# EAGLE schematic Sample and Hold Main (EAGLE 9.6.2)
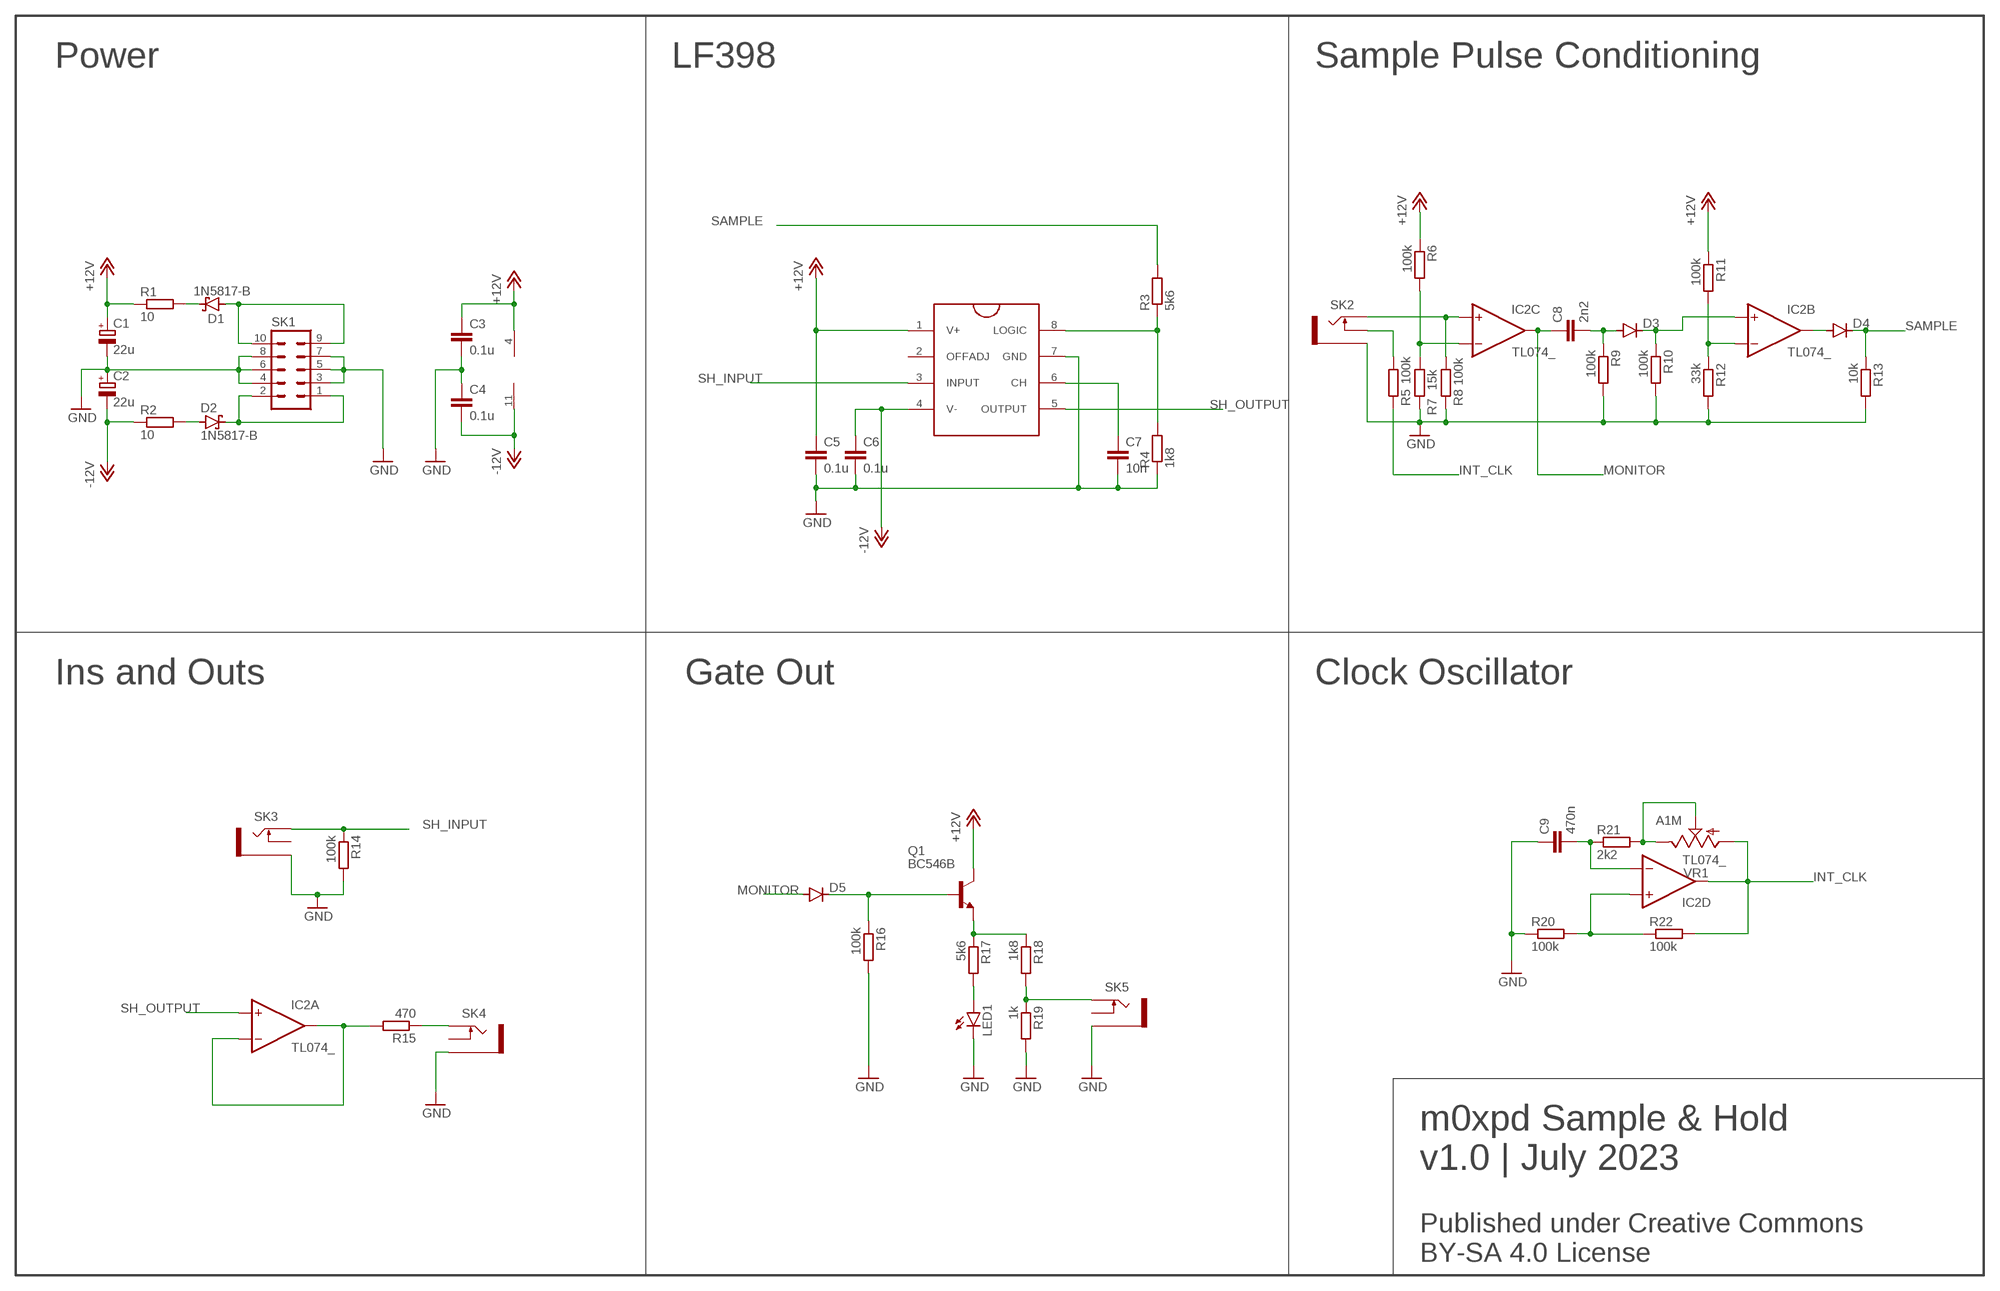
[diagram p0: schematic, sheet 1]

## Parts
C1  22u  CPOL-EUE2.5-6  [E2,5-6]
C2  22u  CPOL-EUE2.5-6  [E2,5-6]
C3  0.1u  C-EU050-024X044  [C050-024X044]
C4  0.1u  C-EU050-024X044  [C050-024X044]
C5  0.1u  C-EU050-024X044  [C050-024X044]
C6  0.1u  C-EU050-024X044  [C050-024X044]
C7  10n  C-EU050-025X075  [C050-025X075]
C8  2n2  C-EU050-024X044  [C050-024X044]
C9  470n  C-EU050-035X075  [C050-035X075]
D1  1N5817-B  [DO41-7.6]
D2  1N5817-B  [DO41-7.6]
D3  1N4148DO35-7  [DO35-7]
D4  1N4148DO35-7  [DO35-7]
D5  1N4148DO35-7  [DO35-7]
IC1  LF398  [DIL08]
IC2  TL074_  [DIL14]
LED1  LED3MM  [LED3MM]
Q1  BC546B  [TO92-EBC]
R1  10  R-EU_0204/7  [0204/7]
R2  10  R-EU_0204/7  [0204/7]
R3  5k6  R-EU_0204/7  [0204/7]
R4  1k8  R-EU_0204/7  [0204/7]
R5  100k  R-EU_0204/7  [0204/7]
R6  100k  R-EU_0204/7  [0204/7]
R7  15k  R-EU_0204/7  [0204/7]
R8  100k  R-EU_0204/7  [0204/7]
R9  100k  R-EU_0204/7  [0204/7]
R10  100k  R-EU_0204/7  [0204/7]
R11  100k  R-EU_0204/7  [0204/7]
R12  33k  R-EU_0204/7  [0204/7]
R13  10k  R-EU_0204/7  [0204/7]
R14  100k  R-EU_0204/7  [0204/7]
R15  470  R-EU_0204/7  [0204/7]
R16  100k  R-EU_0204/7  [0204/7]
R17  5k6  R-EU_0204/7  [0204/7]
R18  1k8  R-EU_0204/7  [0204/7]
R19  1k  R-EU_0204/7  [0204/7]
R20  100k  R-EU_0204/7  [0204/7]
R21  2k2  R-EU_0204/7  [0204/7]
R22  100k  R-EU_0204/7  [0204/7]
SK1  EURO_POWER_HEADERFAT_PADS  [EURO_PWR_HEADER_FAT]
SK2  THONKICONNNEW  [WQP-PJ301M-12_JACK]
SK3  THONKICONNNEW  [WQP-PJ301M-12_JACK]
SK4  THONKICONNNEW  [WQP-PJ301M-12_JACK]
SK5  THONKICONNNEW  [WQP-PJ301M-12_JACK]
VR1  A1M  9MM_SNAP-IN_POT_  [9MM_SNAP-IN_POT]

## Nets
+12V: C1.+ C3.1 C5.1 IC1.1(V+) IC2.4(P:V+) Q1.C R1.1 R6.1 R11.1
-12V: C2.- C4.2 C6.1 IC1.4(V-) IC2.11(P:V-) R2.1
GND: C1.- C2.+ C3.2 C4.1 C5.2 C6.2 C7.2 C9.1 IC1.7(GND) LED1.K(C) R4.1 R7.2 R8.2 R9.2 R10.2 R12.2 R13.2 R14.2 R16.2 R19.2 R20.1 SK1.3 SK1.4 SK1.5 SK1.6 SK1.7 SK1.8 SK2.P$3_SLEEVE(SLEEVE) SK3.P$3_SLEEVE(SLEEVE) SK4.P$3_SLEEVE(SLEEVE) SK5.P$3_SLEEVE(SLEEVE)
INT_CLK: IC2.14(D:OUT) R5.2 R22.2 VR1.1(A)
MONITOR: C8.1 D5.A IC2.8(C:OUT)
N$1: IC2.1(A:OUT) IC2.2(A:-IN) R15.2
N$2: IC2.9(C:-IN) R6.2 R7.1
N$3: R15.1 SK4.P$1_TIP(TIP)
N$4: C7.1 IC1.6(CH)
N$5: IC2.10(C:+IN) R8.1 SK2.P$1_TIP(TIP)
N$6: IC1.8(LOGIC) R3.1 R4.2
N$7: Q1.E R17.1 R18.1
N$8: C8.2 D3.A R9.1
N$9: D3.C IC2.5(B:+IN) R10.1
N$10: LED1.A R17.2
N$11: IC2.6(B:-IN) R11.2 R12.1
N$12: D4.A IC2.7(B:OUT)
N$14: C9.2 IC2.13(D:-IN) R21.1
N$15: IC2.12(D:+IN) R20.2 R22.1
N$16: D5.C Q1.B R16.1
N$17: R21.2 VR1.2(S) VR1.3(E)
N$18: R5.1 SK2.P$2_SWITCH(SWITCH)
N$19: R18.2 R19.1 SK5.P$1_TIP(TIP)
N$20: D2.C SK1.1 SK1.2
N$21: D1.A SK1.9 SK1.10
N$22: D1.C R1.2
N$23: D2.A R2.2
SAMPLE: D4.C R3.2 R13.1
SH_INPUT: IC1.3(INPUT) R14.1 SK3.P$1_TIP(TIP)
SH_OUTPUT: IC1.5(OUTPUT) IC2.3(A:+IN)
Unconnected: IC1.2(OFFADJ) SK3.P$2_SWITCH(SWITCH) SK4.P$2_SWITCH(SWITCH) SK5.P$2_SWITCH(SWITCH)

## Notes on the sheet
- Power | LF398 | Sample Pulse Conditioning
- Ins and Outs | Gate Out | Clock Oscillator
- m0xpd Sample & Hold
- v1.0 | July 2023
- Published under Creative Commons 
  BY-SA 4.0 License

## Library data of the parts
C1 C2 = rcl:CPOL-EU: POLARIZED CAPACITOR, European symbol; SPICEPREFIX: C
C3-C9 = rcl:C-EU: CAPACITOR, European symbol; SPICEPREFIX: C
D1 D2 = diode:1N581*: 1.0A SCHOTTKY BARRIER RECTIFIER Source: http://www.diodes.com/datasheets/ds23001.pdf
D3-D5 = diode:1N4148: DIODE high speed (Philips)
IC1 = MyLibrary:LF398: Sample and Hold device
IC2 = MusicThingModular:TL074: Generic Quad Op Amp
LED1 = led:LED: LED OSRAM: - CHIPLED LG R971, LG N971, LY N971, LG Q971, LY Q971, LO R971, LY R971 LH N974, LH R974 LS Q976, LO Q976, LY Q976 LO Q996 - Hyper CHIPLED LW Q18S LB Q993, LB Q99A, LB R99A - SideLED LS A670, LO A670, LY A670, LG A670, LP A670 LB A673, LV A673, LT A673, LW A673 LH A674 LY A675 LS A676, LA A676, LO A676, LY A676, LW A676 LS A679, LY A679, LG A679 - Hyper Micro SIDELED® LS Y876, LA Y876, LO Y876, LY Y876 LT Y87S - SmartLED LW L88C, LW L88S LB L89C, LB L89S, LG L890 LS L89K, LO L89K, LY L89K LS L896, LA L896, LO L896, LY L896 - TOPLED LS T670, LO T670, LY T670, LG T670, LP T670 LSG T670, LSP T670, LSY T670, LOP T670, LYG T670 LG T671, LOG T671, LSG T671 LB T673, LV T673, LT T673, LW T673 LH T674 LS T676, LA T676, LO T676, LY T676, LB T676, LH T676, LSB T676, LW T676 LB T67C, LV T67C, LT T67C, LS T67K, LO T67K, LY T67K, LW E67C LS E67B, LA E67B, LO E67B, LY E67B, LB E67C, LV E67C, LT E67C LW T67C LS T679, LY T679, LG T679 LS T770, LO T770, LY T770, LG T770, LP T770 LB T773, LV T773, LT T773, LW T773 LH T774 LS E675, LA E675, LY E675, LS T675 LS T776, LA T776, LO T776, LY T776, LB T776 LHGB T686 LT T68C, LB T68C - Hyper Mini TOPLED® LB M676 - Mini TOPLED Santana® LG M470 LS M47K, LO M47K, LY M47K Source: http://www.osram.convergy.de LUXEON: - LUMILED® LXK2-PW12-R00, LXK2-PW12-S00, LXK2-PW14-U00, LXK2-PW14-V00 LXK2-PM12-R00, LXK2-PM12-S00, LXK2-PM14-U00 LXK2-PE12-Q00, LXK2-PE12-R00, LXK2-PE12-S00, LXK2-PE14-T00, LXK2-PE14-U00 LXK2-PB12-K00, LXK2-PB12-L00, LXK2-PB12-M00, LXK2-PB14-N00, LXK2-PB14-P00, LXK2-PB14-Q00 LXK2-PR12-L00, LXK2-PR12-M00, LXK2-PR14-Q00, LXK2-PR14-R00 LXK2-PD12-Q00, LXK2-PD12-R00, LXK2-PD12-S00 LXK2-PH12-R00, LXK2-PH12-S00 LXK2-PL12-P00, LXK2-PL12-Q00, LXK2-PL12-R00 Source: www.luxeon.com KINGBRIGHT: KA-3528ASYC Source: www.kingbright.com
Q1 = transistor-npn:BC546*: NPN Transistor
R1-R22 = rcl:R-EU_: RESISTOR, European symbol; SPICEPREFIX: R
SK1 = MusicThingModular:EURO_POWER_HEADER: Power Header 10 pin power header for Eurorack Power Supplies Variants with fatter pads for easier soldering, and the LOCK variant which has 5mil offset pins to hold the component in place before soldering
SK2-SK5 = MusicThingModular:THONKICONN: 3.5mm socket for Eurorack modular synths
VR1 = MusicThingModular:9MM_SNAP-IN_POT: 9mm vertical snap-in pot, Alpha / Panasonic style